# Altium schematic sheet TX_RUBVERANO.SchDoc
size A3; SheetNumber: 21; SheetTotal: 25
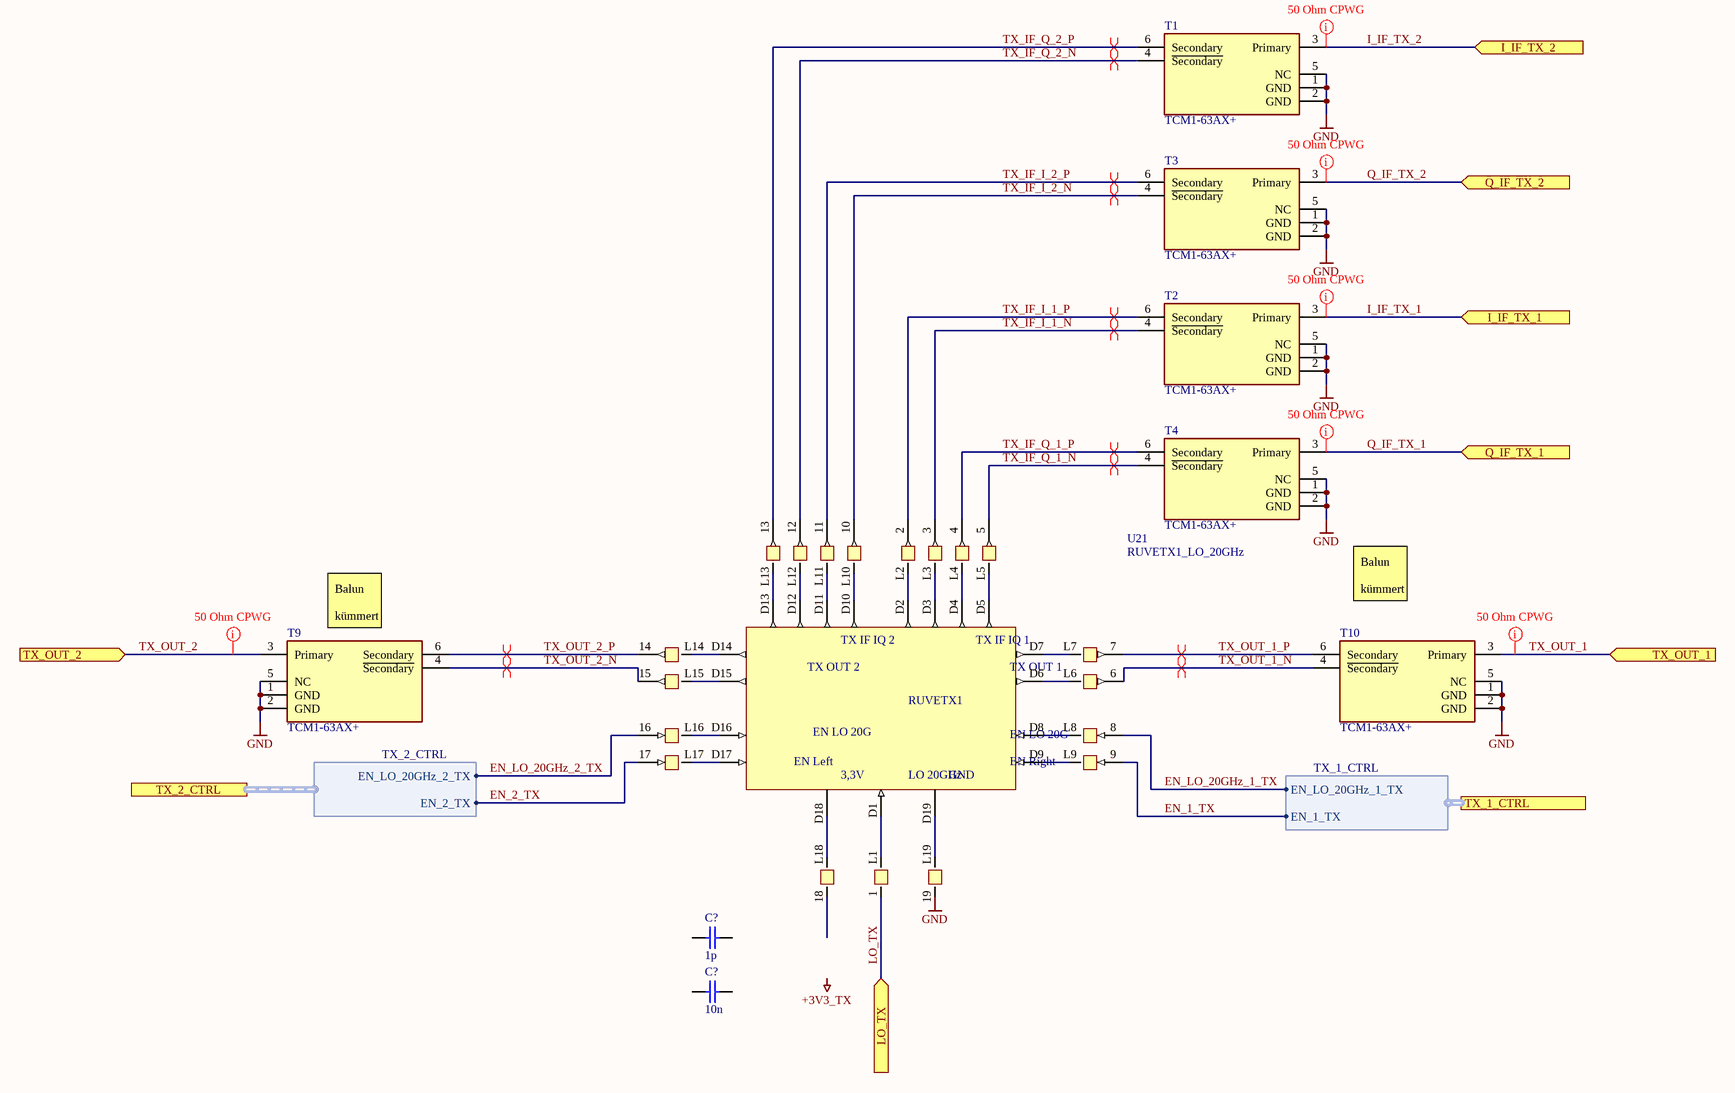
[diagram p0: TX_RUBVERANO.SchDoc]

## Parts
(Parts that share a designator on the sheet are numbered #1, #2 ... from top to bottom, then left to right.)
C?#1  1p  [C_0402_1005Metric_IPC_N]
C?#2  10n  [C_0402_1005Metric_IPC_N]
T1  TCM1-63AX+  [DB1627]
T2  TCM1-63AX+  [DB1627]
T3  TCM1-63AX+  [DB1627]
T4  TCM1-63AX+  [DB1627]
T9  TCM1-63AX+  [DB1627]
T10  TCM1-63AX+  [DB1627]
U21  RUVETX1_LO_20GHz  [RUVETX1_LO_20GHz]

## Ports
I_IF_TX_1 (in, see Top_Level[7B], IF_Connectors[2C]), I_IF_TX_2 (in, see Top_Level[7B], IF_Connectors[2C]), LO_TX (in, see Top_Level[6B]), Q_IF_TX_1 (in, see Top_Level[7B], IF_Connectors[2C]), Q_IF_TX_2 (in, see Top_Level[7B], IF_Connectors[2C]), TX_1_CTRL (harness TX_1_CTRL, see Top_Level[6B], MCU[5C]), TX_2_CTRL (harness TX_2_CTRL, see Top_Level[6B], MCU[5C]), TX_OUT_1 (in, see Top_Level[7B], GSG_TX[2B]), TX_OUT_2 (in, see Top_Level[7B], GSG_TX[2B])

## Harnesses
TX_2_CTRL: EN_2_TX, EN_LO_20GHz_2_TX
TX_1_CTRL: EN_1_TX, EN_LO_20GHz_1_TX

## Nets
GND: T1.1(GND) T1.2(GND) T1.5(NC) T2.1(GND) T2.2(GND) T2.5(NC) T3.1(GND) T3.2(GND) T3.5(NC) T4.1(GND) T4.2(GND) T4.5(NC) T9.1(GND) T9.2(GND) T9.5(NC) T10.1(GND) T10.2(GND) T10.5(NC) U21.19
EN_1_TX: U21.9 ; port TX_1_CTRL.EN_1_TX
EN_2_TX: U21.17 ; port TX_2_CTRL.EN_2_TX
EN_LO_20GHz_1_TX: U21.8 ; port TX_1_CTRL.EN_LO_20GHz_1_TX
EN_LO_20GHz_2_TX: U21.16 ; port TX_2_CTRL.EN_LO_20GHz_2_TX
I_IF_TX_1: T2.3(Primary) ; port I_IF_TX_1
I_IF_TX_2: T1.3(Primary) ; port I_IF_TX_2
LO_TX: U21.1 ; port LO_TX
Q_IF_TX_1: T4.3(Primary) ; port Q_IF_TX_1
Q_IF_TX_2: T3.3(Primary) ; port Q_IF_TX_2
TX_IF_I_1_N: T2.4(~{Secondary}) U21.3
TX_IF_I_1_P: T2.6(Secondary) U21.2
TX_IF_I_2_N: T3.4(~{Secondary}) U21.10
TX_IF_I_2_P: T3.6(Secondary) U21.11
TX_IF_Q_1_N: T4.4(~{Secondary}) U21.5
TX_IF_Q_1_P: T4.6(Secondary) U21.4
TX_IF_Q_2_N: T1.4(~{Secondary}) U21.12
TX_IF_Q_2_P: T1.6(Secondary) U21.13
TX_OUT_1: T10.3(Primary) ; port TX_OUT_1
TX_OUT_1_N: T10.4(~{Secondary}) U21.6
TX_OUT_1_P: T10.6(Secondary) U21.7
TX_OUT_2: T9.3(Primary) ; port TX_OUT_2
TX_OUT_2_N: T9.4(~{Secondary}) U21.15
TX_OUT_2_P: T9.6(Secondary) U21.14
NetU21_D1: U21.D1 U21.L1
NetU21_D2: U21.D2 U21.L2
NetU21_D3: U21.D3 U21.L3
NetU21_D4: U21.D4 U21.L4
NetU21_D5: U21.D5 U21.L5
NetU21_D6: U21.D6 U21.L6
NetU21_D7: U21.D7 U21.L7
NetU21_D8: U21.D8 U21.L8
NetU21_D9: U21.D9 U21.L9
NetU21_D10: U21.D10 U21.L10
NetU21_D11: U21.D11 U21.L11
NetU21_D12: U21.D12 U21.L12
NetU21_D13: U21.D13 U21.L13
NetU21_D14: U21.D14 U21.L14
NetU21_D15: U21.D15 U21.L15
NetU21_D16: U21.D16 U21.L16
NetU21_D17: U21.D17 U21.L17
NetU21_D18: U21.D18 U21.L18
NetU21_D19: U21.D19 U21.L19

Not connected (* = marked no-connect by the designer): C?#1 1 2; C?#2 1 2; U21 18

## Layout directives
differential pair: TX_IF_I_1_N, TX_IF_I_1_P, TX_IF_I_2_N, TX_IF_I_2_P, TX_IF_Q_1_N, TX_IF_Q_1_P, TX_IF_Q_2_N, TX_IF_Q_2_P, TX_OUT_1_N, TX_OUT_1_P, TX_OUT_2_N, TX_OUT_2_P
net class 50Ohm_CPWG: I_IF_TX_1, I_IF_TX_2, Q_IF_TX_1, Q_IF_TX_2, TX_OUT_1, TX_OUT_2

## Notes on the sheet
- Balun
  kümmert sich Tobi drum
- (near T9) Balun
  kümmert sich Tobi drum
- Labels drawn without touching a wire or pin: +3V3_TX
- (in symbol RF000012) TX IF IQ 2; TX IF IQ 1; TX OUT 2; TX OUT 1; RUVETX1; EN LO 20G; EN Left; EN Right; 3,3V; LO 20GHz; GND

## Library data of the parts
C?#1 C?#2 = C000002: Generic MLCC with 0402 Footprint; Specific Component: False; ID: C000002; Tolerance: *; Temp Coefficient: *; Voltage Rated: *; min Temperature: *; max Temperature: *; Case: 0402
  C?#1: Capacitance: 1p
  C?#2: Capacitance: 10n
T1-T4 T9 T10 = RF000014: Manufacturer: Minicircuits; Type: Balun; ID: RF000014; Manufacturer Part Number: TCM1-63AX+; Part Value: TCM1-63AX+; Case: DB1627; ComponentLink1Description: Datasheet; ComponentLink1URL: https://www.minicircuits.com/pdfs/TCM1-63AX+.pdf; Supplier 1: Mouser; Supplier Part Number 1: 139-TCM1-63AX; Supplier 2: Digikey; Supplier Part Number 2: 3157-TCM1-63AX+CT-ND
U21 = RF000012: RUVETX1 LO-Eingang bei 20 GHz; Manufacturer: RUB; ID: RF000012; Type: Radar Transmitter; Manufacturer Part Number: RUVETX1_LO_20GHz; Part Value: RUVETX1_LO_20GHz; Case: custom